# Altium schematic sheet DM3370_PCIE_CLK.SchDoc: =project_title
size Tabloid; CompanyName: Luxonis Holding; Organization: Luxonis Holding; Address1: 1925 Harmony Park Drive; Address2: Westminster, CO; Address3: 80234; Address4: United States; DocumentNumber: 13; SheetNumber: 13; SheetTotal: 17
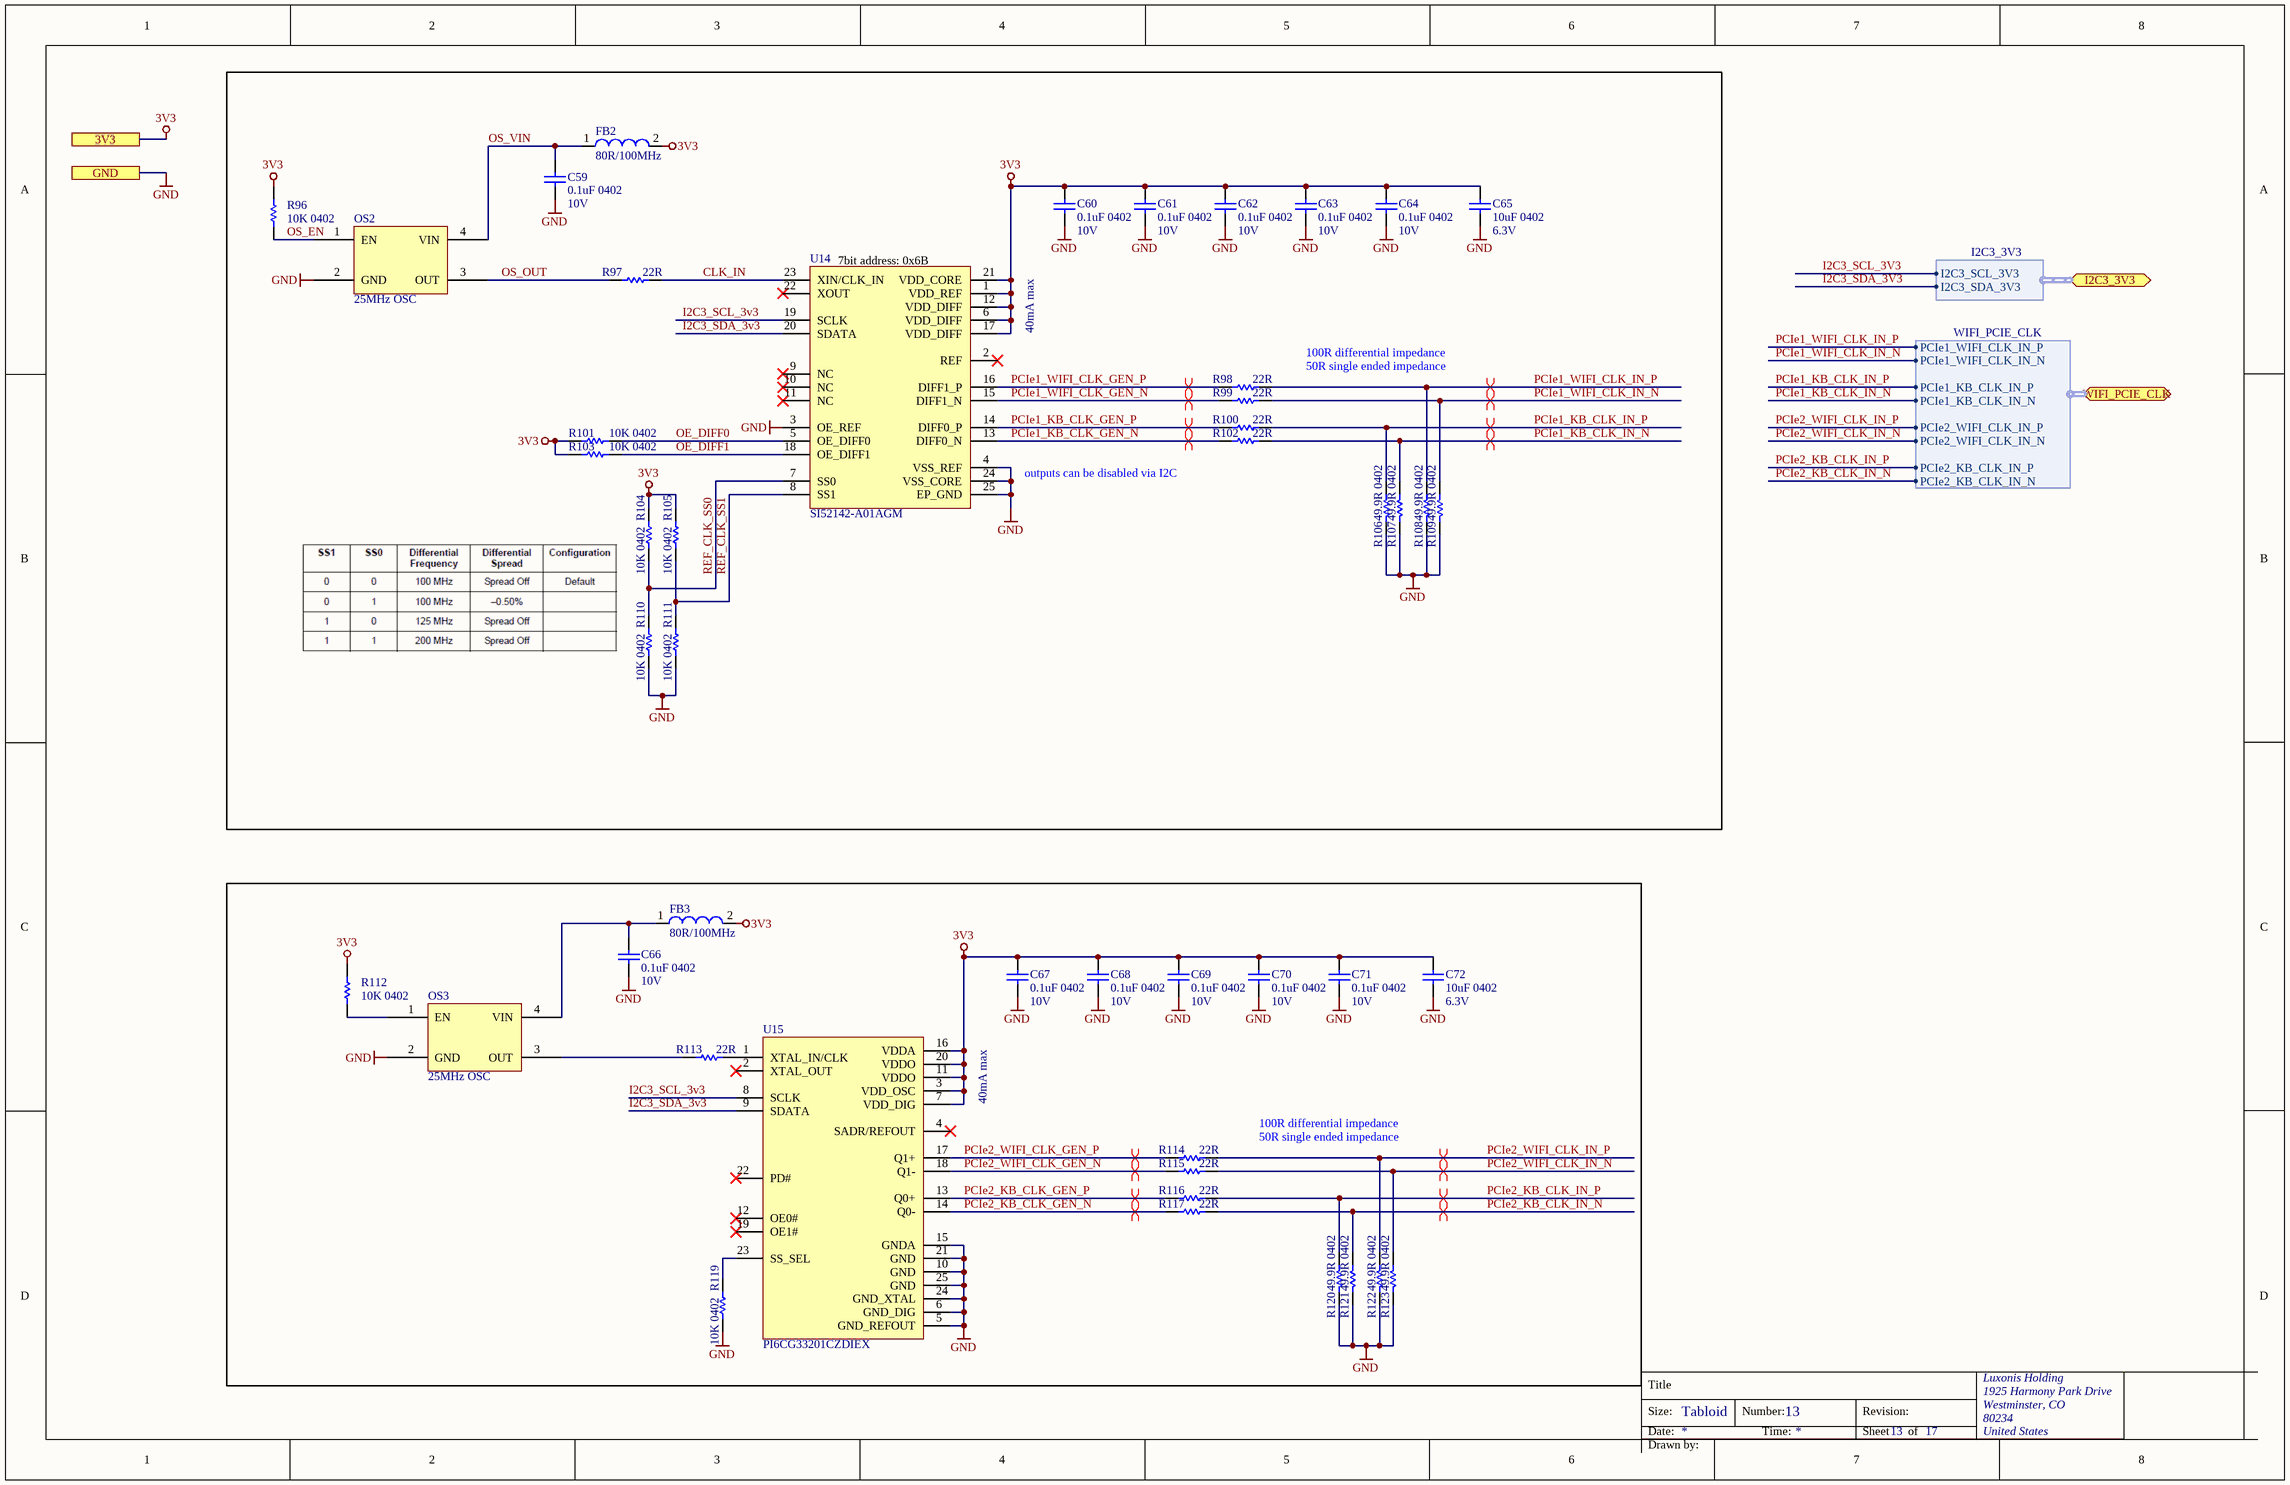
[diagram p0: DM3370_PCIE_CLK.SchDoc]

## Parts
C59  0.1uF 0402  Voltage Rating: 10V  [CAPC0402(1005)70_L]
C60  0.1uF 0402  Voltage Rating: 10V  [CAPC0402(1005)70_L]
C61  0.1uF 0402  Voltage Rating: 10V  [CAPC0402(1005)70_L]
C62  0.1uF 0402  Voltage Rating: 10V  [CAPC0402(1005)70_L]
C63  0.1uF 0402  Voltage Rating: 10V  [CAPC0402(1005)70_L]
C64  0.1uF 0402  Voltage Rating: 10V  [CAPC0402(1005)70_L]
C65  10uF 0402  Voltage Rating: 6.3V  [CAPC0402(1005)70_L]
C66  0.1uF 0402  Voltage Rating: 10V  [CAPC0402(1005)70_L]
C67  0.1uF 0402  Voltage Rating: 10V  [CAPC0402(1005)70_L]
C68  0.1uF 0402  Voltage Rating: 10V  [CAPC0402(1005)70_L]
C69  0.1uF 0402  Voltage Rating: 10V  [CAPC0402(1005)70_L]
C70  0.1uF 0402  Voltage Rating: 10V  [CAPC0402(1005)70_L]
C71  0.1uF 0402  Voltage Rating: 10V  [CAPC0402(1005)70_L]
C72  10uF 0402  Voltage Rating: 6.3V  [CAPC0402(1005)70_L]
FB2  80R/100MHz  [BK1608HS800-T_L]
FB3  80R/100MHz  [BK1608HS800-T_L]
OS2  25MHz OSC  [2520_OSC(FJ2400002)]
OS3  25MHz OSC  [2520_OSC(FJ2400002)]
R96  10K 0402  [RESC0402(1005)_L]
R97  Resistance: 22R  [RESC0402(1005)_L]  (hidden comment: RC0402FR-0722RL)
R98  Resistance: 22R  [RESC0402(1005)_L]  (hidden comment: RC0402FR-0722RL)
R99  Resistance: 22R  [RESC0402(1005)_L]  (hidden comment: RC0402FR-0722RL)
R100  Resistance: 22R  [RESC0402(1005)_L]  (hidden comment: RC0402FR-0722RL)
R101  10K 0402  [RESC0402(1005)_L]
R102  Resistance: 22R  [RESC0402(1005)_L]  (hidden comment: RC0402FR-0722RL)
R103  10K 0402  [RESC0402(1005)_L]
R104  10K 0402  [RESC0402(1005)_L]
R105  10K 0402  [RESC0402(1005)_L]
R106  49.9R 0402  [RESC0402(1005)_L]
R107  49.9R 0402  [RESC0402(1005)_L]
R108  49.9R 0402  [RESC0402(1005)_L]
R109  49.9R 0402  [RESC0402(1005)_L]
R110  10K 0402  [RESC0402(1005)_L]
R111  10K 0402  [RESC0402(1005)_L]
R112  10K 0402  [RESC0402(1005)_L]
R113  Resistance: 22R  [RESC0402(1005)_L]  (hidden comment: RC0402FR-0722RL)
R114  Resistance: 22R  [RESC0402(1005)_L]  (hidden comment: RC0402FR-0722RL)
R115  Resistance: 22R  [RESC0402(1005)_L]  (hidden comment: RC0402FR-0722RL)
R116  Resistance: 22R  [RESC0402(1005)_L]  (hidden comment: RC0402FR-0722RL)
R117  Resistance: 22R  [RESC0402(1005)_L]  (hidden comment: RC0402FR-0722RL)
R119  10K 0402  [RESC0402(1005)_L]
R120  49.9R 0402  [RESC0402(1005)_L]
R121  49.9R 0402  [RESC0402(1005)_L]
R122  49.9R 0402  [RESC0402(1005)_L]
R123  49.9R 0402  [RESC0402(1005)_L]
U14  SI52142-A01AGM  [SI52142-A01AGM]
U15  PI6CG33201CZDIEX  [PI6CG33201CZDIEX]

## Ports
3V3, GND, I2C3_3V3 (bidir, harness I2C3_3V3), WIFI_PCIE_CLK (bidir, harness WIFI_PCIE_CLK)

## Harnesses
WIFI_PCIE_CLK: PCIe1_WIFI_CLK_IN_P, PCIe1_WIFI_CLK_IN_N, PCIe1_KB_CLK_IN_P, PCIe1_KB_CLK_IN_N, PCIe2_WIFI_CLK_IN_P, PCIe2_WIFI_CLK_IN_N, PCIe2_KB_CLK_IN_P, PCIe2_KB_CLK_IN_N
I2C3_3V3: I2C3_SCL_3V3, I2C3_SDA_3V3

## Nets
3V3: C60.1 C61.1 C62.1 C63.1 C64.1 C65.2 C67.1 C68.1 C69.1 C70.1 C71.1 C72.2 FB2.2 FB3.2 R96.2 R101.1 R103.1 R104.1 R105.1 R112.2 U14.1(VDD_REF) U14.6(VDD_DIFF) U14.12(VDD_DIFF) U14.17(VDD_DIFF) U14.21(VDD_CORE) U15.3(VDD_OSC) U15.7(VDD_DIG) U15.11(VDDO) U15.16(VDDA) U15.20(VDDO) ; port 3V3
GND: C59.2 C60.2 C61.2 C62.2 C63.2 C64.2 C65.1 C66.2 C67.2 C68.2 C69.2 C70.2 C71.2 C72.1 OS2.2(GND) OS3.2(GND) R106.2 R107.1 R108.1 R109.1 R110.2 R111.2 R119.2 R120.2 R121.1 R122.1 R123.1 U14.3(OE_REF) U14.4(VSS_REF) U14.24(VSS_CORE) U14.25(EP_GND) U15.5(GND_REFOUT) U15.6(GND_DIG) U15.10(GND) U15.15(GNDA) U15.21(GND) U15.24(GND_XTAL) U15.25(GND) ; port GND
CLK_IN: R97.2 U14.23(XIN/CLK_IN)
I2C3_SCL_3v3: U14.19(SCLK) U15.8(SCLK) ; port I2C3_3V3.I2C3_SCL_3V3
I2C3_SDA_3v3: U14.20(SDATA) U15.9(SDATA) ; port I2C3_3V3.I2C3_SDA_3V3
OE_DIFF0: R101.2 U14.5(OE_DIFF0)
OE_DIFF1: R103.2 U14.18(OE_DIFF1)
OS_EN: OS2.1(EN) R96.1
OS_OUT: OS2.3(OUT) R97.1
OS_VIN: C59.1 FB2.1 OS2.4(VIN)
PCIe1_KB_CLK_GEN_N: R102.1 U14.13(DIFF0_N)
PCIe1_KB_CLK_GEN_P: R100.1 U14.14(DIFF0_P)
PCIe1_KB_CLK_IN_N: R102.2 R107.2 ; port WIFI_PCIE_CLK.PCIe1_KB_CLK_IN_N
PCIe1_KB_CLK_IN_P: R100.2 R106.1 ; port WIFI_PCIE_CLK.PCIe1_KB_CLK_IN_P
PCIe1_WIFI_CLK_GEN_N: R99.1 U14.15(DIFF1_N)
PCIe1_WIFI_CLK_GEN_P: R98.1 U14.16(DIFF1_P)
PCIe1_WIFI_CLK_IN_N: R99.2 R109.2 ; port WIFI_PCIE_CLK.PCIe1_WIFI_CLK_IN_N
PCIe1_WIFI_CLK_IN_P: R98.2 R108.2 ; port WIFI_PCIE_CLK.PCIe1_WIFI_CLK_IN_P
PCIe2_KB_CLK_GEN_N: R117.1 U15.14(Q0-)
PCIe2_KB_CLK_GEN_P: R116.1 U15.13(Q0+)
PCIe2_KB_CLK_IN_N: R117.2 R121.2 ; port WIFI_PCIE_CLK.PCIe2_KB_CLK_IN_N
PCIe2_KB_CLK_IN_P: R116.2 R120.1 ; port WIFI_PCIE_CLK.PCIe2_KB_CLK_IN_P
PCIe2_WIFI_CLK_GEN_N: R115.1 U15.18(Q1-)
PCIe2_WIFI_CLK_GEN_P: R114.1 U15.17(Q1+)
PCIe2_WIFI_CLK_IN_N: R115.2 R123.2 ; port WIFI_PCIE_CLK.PCIe2_WIFI_CLK_IN_N
PCIe2_WIFI_CLK_IN_P: R114.2 R122.2 ; port WIFI_PCIE_CLK.PCIe2_WIFI_CLK_IN_P
REF_CLK_SS0: R104.2 R110.1 U14.7(SS0)
REF_CLK_SS1: R105.2 R111.1 U14.8(SS1)
NetC66_1: C66.1 FB3.1 OS3.4(VIN)
NetOS3_1: OS3.1(EN) R112.1
NetOS3_3: OS3.3(OUT) R113.1
NetR113_2: R113.2 U15.1(XTAL_IN/CLK)
NetR119_1: R119.1 U15.23(SS_SEL)

Not connected (* = marked no-connect by the designer): U14 2(REF)* 9(NC)* 10(NC)* 11(NC)* 22(XOUT)*; U15 2(XTAL_OUT)* 4(SADR/REFOUT)* 12(OE0#)* 19(OE1#)* 22(PD#)*

## Layout directives
differential pair; net class PCIE; differential pair class 100ohm: PCIe1_KB_CLK_GEN_N, PCIe1_KB_CLK_GEN_P, PCIe1_KB_CLK_IN_N, PCIe1_KB_CLK_IN_P, PCIe1_WIFI_CLK_GEN_N, PCIe1_WIFI_CLK_GEN_P, PCIe1_WIFI_CLK_IN_N, PCIe1_WIFI_CLK_IN_P, PCIe2_KB_CLK_GEN_N, PCIe2_KB_CLK_GEN_P, PCIe2_KB_CLK_IN_N, PCIe2_KB_CLK_IN_P, PCIe2_WIFI_CLK_GEN_N, PCIe2_WIFI_CLK_GEN_P, PCIe2_WIFI_CLK_IN_N, PCIe2_WIFI_CLK_IN_P

## Notes on the sheet
- (near U14) 7bit address: 0x6B
- 40mA max
- 100R differential impedance
- 50R single ended impedance
- outputs can be disabled via I2C
- Schematic based on the PCIe refclk and control circuitry on the MV0235 reference design.
- Title
- Size:
- Date:
- Tabloid
- Number:
- Time:
- Revision:
- Sheet
- of
- Drawn by:

## Library data of the parts
C59-C64 C66-C71 = GRM155R71A104JA01D: CAP CER 0.1UF 10V X7R 0402 5%; Manufacturer 1: Murata; Capacitance: 100nF; Supplier 1: Digi-Key; Manufacturer Part Number 1: GRM155R71A104JA01D; Stock 1: 1346709; Pricing 1: 1=0.10000, 10=0.02500, 100=0.01130, 500=0.00806, 1000=0.00633, 2500=0.00575, 5000=0.00529 (USD); RoHS: Yes; Mount: Surface Mount; Case/Package: 0402; Case Code (Imperial): 0402; Case Code (Metric): 1005; Min Operating Temperature: -55°C; Max Operating Temperature: 125°C; Tolerance: 5%; Packaging: Tape and Reel; Voltage Rating (DC): 10V; Dielectric: X7R; Package Quantity: 10000; Termination: SMD/SMT; Length: 1mm; Height: 0.5mm; Width: 0.02inch; Thickness: 0.022inch; Depth: 0.5mm; Radiation Hardening: No; Lead Free: Lead Free; ComponentLink1URL: https://datasheet.ciiva.com/5411/product-5411135.pdf?src-supplier=Mouser; ComponentLink1Description: https://datasheet.ciiva.com/5411/product-5411135.pdf?src-supplier=Mouser; ComponentLink2URL: https://datasheet.ciiva.com/11618/c02e-11618821.pdf?src-supplier=Avnet; ComponentLink2Description: https://datasheet.ciiva.com/11618/c02e-11618821.pdf?src-supplier=Avnet; Supplier Part Number 1: 490-10777-1-ND
C65 C72 = GRM155R60J106ME15D: CAP CER 10UF 6.3V X5R 0402 20%; Manufacturer 1: Murata; Supplier 1: Digi-Key; Manufacturer Part Number 1: GRM155R60J106ME15D; Stock 1: 1839627; Pricing 1: 1=0.23000, 10=0.15700, 100=0.07950, 500=0.05442, 1000=0.04814, 2500=0.04605, 5000=0.04186 (USD); RoHS: Yes; Mount: Surface Mount; Case/Package: 0402; Case Code (Metric): 1005; Case Code (Imperial): 0402; Min Operating Temperature: -55°C; Max Operating Temperature: 85°C; Packaging: Tape and Reel; Capacitance: 10uF; Dielectric: X5R; Length: 0.039inch; Width: 0.02inch; ComponentLink1URL: https://www.murata.com/~/media/webrenewal/support/library/catalog/products/capacitor/mlcc/c02e.ashx?la=en-us&src-supplier=Digi-Key; ComponentLink1Description: https://www.murata.com/~/media/webrenewal/support/library/catalog/products/capacitor/mlcc/c02e.ashx?la=en-us&src-supplier=Digi-Key; Supplier Part Number 1: 490-13238-1-ND; Voltage Rating (DC): 6.3V; Thickness: 0.026inch; Tolerance: 20%
FB2 FB3 = BK1608HS800-T: FERRITE BEAD 80 OHM 0603 1LN; Manufacturer 1: Taiyo Yuden; Impedance: 80R; Tolerance: 25%; Max DC Current: 600mA; DC Resistance (DCR): 100mR; Test Frequency: 100MHz; Number of Lines: 1; Shielding: Shielded; Supplier 1: Digi-Key; Manufacturer Part Number 1: BK1608HS800-T; Stock 1: 6285; Pricing 1: 1=0.10000, 10=0.07900, 25=0.07200, 50=0.06480, 100=0.04760, 250=0.03460, 500=0.03170, 1000=0.02738 (USD); RoHS: Yes; Mount: Surface Mount; Case/Package: 0603; Number of Pins: 2; Core Material: Ferrite; Case Code (Metric): 1608; Case Code (Imperial): 0603; Min Operating Temperature: -55°C; Max Operating Temperature: 125°C; Package Quantity: 1; Packaging: Tape and Reel; Termination: SMD/SMT; Max Current Rating: 600mA; Frequency: 100MHz; Length: 0.063inch; Height: 0.037inch; Width: 0.8mm; Depth: 0.95mm; REACH SVHC: Unknown; Lead Free: Lead Free; Halogen Free: Halogen Free; ComponentLink1URL: https://datasheet.ciiva.com/1011/bk1608hs800-t-ss-1011885.pdf?src-supplier=Digi-Key; ComponentLink1Description: https://datasheet.ciiva.com/1011/bk1608hs800-t-ss-1011885.pdf?src-supplier=Digi-Key; ComponentLink2URL: https://datasheet.ciiva.com/1011/mlci07-e-1011886.pdf?src-supplier=Digi-Key; ComponentLink2Description: https://datasheet.ciiva.com/1011/mlci07-e-1011886.pdf?src-supplier=Digi-Key; ComponentLink3URL: https://datasheet.ciiva.com/1011/mlci07-e-1011887.pdf?src-supplier=Digi-Key; ComponentLink3Description: https://datasheet.ciiva.com/1011/mlci07-e-1011887.pdf?src-supplier=Digi-Key; Supplier 2: Mouser; Supplier 3: Arrow; Supplier Part Number 1: 587-1875-1-ND; Supplier Part Number 2: 963-BK1608HS800-T; Supplier Part Number 3: BK1608HS800-T
OS2 OS3 = ASDMB-25.000MHZ-LC-T: MEMS OSC XO 25.0000MHZ LVCMOS; Manufacturer 1: Abracon; Load Capacitance: 15pF; Operating Supply Voltage: 3.3V; Max Supply Voltage: 4V; Min Supply Voltage: -300mV; Max Supply Current: 16mA; Frequency Stability: 50ppm; Supplier 1: Digi-Key; Manufacturer Part Number 1: ASDMB-25.000MHZ-LC-T; RoHS: Yes; Category: Oscillators; Stock 1: 3088; Pricing 1: 1=2.09000, 10=1.99800, 50=1.95200, 100=1.67310, 500=1.62662 (USD); Mount: Surface Mount; Case/Package: SMD/SMT; Number of Pins: 4; Min Operating Temperature: -40°C; Max Operating Temperature: 85°C; Packaging: Tape and Reel; Frequency: 25MHz; Termination: SMD/SMT; Length: 0.098inch; Height: 0.035inch; Width: 0.079inch; Lead Free: Lead Free; ComponentLink1URL: https://datasheet.ciiva.com/868/asdmb-868249.pdf?src-supplier=Digi-Key; ComponentLink1Description: https://datasheet.ciiva.com/868/asdmb-868249.pdf?src-supplier=Digi-Key; ComponentLink2URL: https://datasheet.ciiva.com/868/asdmb-868250.pdf?src-supplier=Digi-Key; ComponentLink2Description: https://datasheet.ciiva.com/868/asdmb-868250.pdf?src-supplier=Digi-Key; ComponentLink3URL: https://datasheet.ciiva.com/868/asdmb-868251.pdf?src-supplier=Digi-Key; ComponentLink3Description: https://datasheet.ciiva.com/868/asdmb-868251.pdf?src-supplier=Digi-Key; ComponentLink4URL: https://datasheet.ciiva.com/13166/asdmb-29928-13166571.pdf?src-supplier=Mouser; ComponentLink4Description: https://datasheet.ciiva.com/13166/asdmb-29928-13166571.pdf?src-supplier=Mouser; Supplier 2: Newark; Supplier 3: Mouser; Supplier Part Number 3: 815-ASDMB-25MHZ-LC; Supplier Part Number 2: 56AC7555; Supplier Part Number 1: 535-11730-1-ND
R96 R101 R103-R105 R110-R112 R119 = RC0402FR-1310KL: RES SMD 10K OHM 1% 0402 1/16W Chip Resistor, 0402 [1005 Metric], 10 kohm, RC Series, 50 V, Thick Film, 62.5 mW; Manufacturer 1: Yageo; Resistance: 10kR; Temperature Coefficient: 100ppm/°C; Power Rating: 62.5mW; Voltage Rating: 50V; ComponentLink1URL: https://datasheet.ciiva.com/16940/pyu-rc0402-51-rohs-l-6-16940293.pdf?src-supplier=Avnet+Europe; ComponentLink1Description: https://datasheet.ciiva.com/16940/pyu-rc0402-51-rohs-l-6-16940293.pdf?src-supplier=Avnet+Europe; ComponentLink2URL: https://datasheet.ciiva.com/28386/pyu-rc0402-51-rohs-l-6-28386855.pdf?src-supplier=Avnet+Europe; ComponentLink2Description: https://datasheet.ciiva.com/28386/pyu-rc0402-51-rohs-l-6-28386855.pdf?src-supplier=Avnet+Europe; ComponentLink3URL: https://datasheet.ciiva.com/16740/pyu-rc0402-51-rohs-l-6-r-16740602.pdf?src-supplier=Future+Electronics; ComponentLink3Description: https://datasheet.ciiva.com/16740/pyu-rc0402-51-rohs-l-6-r-16740602.pdf?src-supplier=Future+Electronics; ComponentLink4URL: https://datasheet.ciiva.com/8891/pyu-rc0402-51-rohs-l-6-8891339.pdf?src-supplier=Avnet; ComponentLink4Description: https://datasheet.ciiva.com/8891/pyu-rc0402-51-rohs-l-6-8891339.pdf?src-supplier=Avnet; ComponentLink5URL: https://datasheet.ciiva.com/5557/pyu-rc0402-51-rohs-l-6-r-5557997.pdf?src-supplier=Mouser; ComponentLink5Description: https://datasheet.ciiva.com/5557/pyu-rc0402-51-rohs-l-6-r-5557997.pdf?src-supplier=Mouser; ComponentLink6URL: https://datasheet.ciiva.com/7983/1018594-7983533.pdf?src-supplier=Element14; ComponentLink6Description: https://datasheet.ciiva.com/7983/1018594-7983533.pdf?src-supplier=Element14; Supplier 1: Newark; Manufacturer Part Number 1: RC0402FR-1310KL; Stock 1: 62239; Pricing 1: 1=0.10000, 25=0.01200, 100=0.00400, 250=0.00400, 500=0.00300, 1000=0.00300 (USD); RoHS: Yes; Case/Package: 0402; Number of Pins: 2; Contact Plating: Tin,Matte,Lead; Case Code (Imperial): 0402; Case Code (Metric): 1005; Min Operating Temperature: -55°C; Max Operating Temperature: 155°C; Tolerance: 1%; Composition: Thick Film; Packaging: Tape and Reel; Termination: SMD/SMT; Military Standard: Not; Voltage Rating (DC): 50V; Working Voltage: 50V; Number of Terminations: 2; Length: 1mm; Depth: 0.5mm; Radiation Hardening: No; REACH SVHC: No SVHC; Lead Free: Lead Free; Supplier Part Number 1: 67R9960; Supplier 2: Future Electronics; Supplier 3: Mouser; Supplier 4: Element14; Supplier Part Number 2: RC0402FR-1310KL-CUTT; Supplier Part Number 3: 603-RC0402FR-1310KL; Supplier Part Number 4: 1799235
R97-R100 R102 R113-R117 = CMP-013-000012-2: RES SMD 22 OHM 1% 1/16W 0402; Manufacturer 1: Yageo; Rated Power Dissipation (P): 62.5mW; Category: Chip SMD Resistors; Manufacturer Part Number 1: RC0402FR-0722RL; Tolerance: 1%; Min Operating Temperature: -55°C; RoHS Compliant: Yes; Number of Pins: 2; Design Item ID: RC0402FR-0722RL; Max Operating Temperature: 155°C
R106-R109 R120-R123 = RC0402FR-0749R9L: RES SMD 49.9 OHM 1% 1/16W 0402; Manufacturer 1: Yageo; Power Rating: 62.5mW; Temperature Coefficient: 100ppm/°C; Voltage Rating: 50V; Max Power Dissipation: 63mW; Supplier 1: Digi-Key; Manufacturer Part Number 1: RC0402FR-0749R9L; Stock 1: 15110719; Pricing 1: 1=0.10000, 10=0.01600, 100=0.00640, 1000=0.00289, 2500=0.00251, 5000=0.00207 (USD); RoHS: Yes; Case/Package: 0402; Number of Pins: 2; Case Code (Imperial): 0402; Case Code (Metric): 1005; Min Operating Temperature: -55°C; Max Operating Temperature: 155°C; Packaging: Tape and Reel; Resistance: 49.9R; Tolerance: 1%; Composition: Thick Film; Number of Terminations: 2; Package Quantity: 1; Termination: SMD/SMT; Military Standard: Not; Voltage Rating (DC): 50V; Features: Moisture Resistant; Working Voltage: 50V; Length: 1mm; Height: 0.016inch; Width: 0.5mm; Depth: 0.5mm; Lead Free: Lead Free; REACH SVHC: No SVHC; ComponentLink1URL: https://datasheet.ciiva.com/11819/0900766b80c66297-11819508.pdf?src-supplier=RSComponents; ComponentLink1Description: https://datasheet.ciiva.com/11819/0900766b80c66297-11819508.pdf?src-supplier=RSComponents; ComponentLink2URL: https://datasheet.ciiva.com/7983/1018594-7983542.pdf?src-supplier=Element14; ComponentLink2Description: https://datasheet.ciiva.com/7983/1018594-7983542.pdf?src-supplier=Element14; ComponentLink3URL: https://datasheet.ciiva.com/16743/pyu-rc0402-51-rohs-l-6-r-16743942.pdf?src-supplier=Future+Electronics; ComponentLink3Description: https://datasheet.ciiva.com/16743/pyu-rc0402-51-rohs-l-6-r-16743942.pdf?src-supplier=Future+Electronics; ComponentLink4URL: https://datasheet.ciiva.com/22747/1018594-22747514.pdf?src-supplier=Element14; ComponentLink4Description: https://datasheet.ciiva.com/22747/1018594-22747514.pdf?src-supplier=Element14; ComponentLink5URL: https://datasheet.ciiva.com/2453/pyu-r-int-thick-7-2453355.pdf?src-supplier=Digi-Key; ComponentLink5Description: https://datasheet.ciiva.com/2453/pyu-r-int-thick-7-2453355.pdf?src-supplier=Digi-Key; ComponentLink6URL: https://datasheet.ciiva.com/2453/pyu-r-int-thick-7-2453356.pdf?src-supplier=Digi-Key; ComponentLink6Description: https://datasheet.ciiva.com/2453/pyu-r-int-thick-7-2453356.pdf?src-supplier=Digi-Key; ComponentLink7URL: https://datasheet.ciiva.com/2453/pyu-r-int-thick-7-2453357.pdf?src-supplier=Digi-Key; ComponentLink7Description: https://datasheet.ciiva.com/2453/pyu-r-int-thick-7-2453357.pdf?src-supplier=Digi-Key; Supplier 2: Mouser; Supplier Part Number 1: 311-49.9LRCT-ND; Supplier Part Number 2: 603-RC0402FR-0749R9L
U14 = CMP-099-000003-1: IC CLK GENERATOR 200MHZ 24QFN; Manufacturer 1: Silicon Labs; Max Supply Voltage: 3.465V; PLL: Yes; Operating Supply Voltage: 3.3V; Input: Clock; Number of Outputs: 2; Min Supply Voltage: 3.135V; Frequency: 100MHz; Number of Circuits: 1; Max Duty Cycle: 55%; Category: Clock and Timing; Manufacturer Part Number 1: SI52142-A01AGM; Number of Pins: 24; ComponentLink2URL: https://datasheet.ciiva.com/26919/getdatasheetpartid-550913-26919827.pdf?src-supplier=Verical; Max Frequency: 200MHz; ComponentLink3URL: https://datasheet.ciiva.com/46413/1813417-46413349.pdf?src-supplier=Element14; Design Item ID: SI52142-A01AGM; Package Quantity: 490; ComponentLink4Description: https://datasheet.ciiva.com/4771/si52142-4771159.pdf?src-supplier=Mouser; Source: NG2391C-HM.SchLib; Length: 4mm; Stock 1: 398; Radiation Hardening: No; Packaging: Tray; ComponentLink2Description: https://datasheet.ciiva.com/26919/getdatasheetpartid-550913-26919827.pdf?src-supplier=Verical; Min Operating Temperature: -40°C; ComponentLink1URL: https://datasheet.ciiva.com/1178/si52142-1178690.pdf?src-supplier=Digi-Key; ComponentLink4URL: https://datasheet.ciiva.com/4771/si52142-4771159.pdf?src-supplier=Mouser; REACH SVHC: Unknown; ComponentLink1Description: https://datasheet.ciiva.com/1178/si52142-1178690.pdf?src-supplier=Digi-Key; ComponentLink3Description: https://datasheet.ciiva.com/46413/1813417-46413349.pdf?src-supplier=Element14; Max Operating Temperature: 85°C; Width: 4mm; Pricing 1: 1=1.81000, 25=1.66320, 100=1.51200, 1000=1.36080 (USD); RoHS: Yes; Case/Package: QFN; Height: 0.75mm
U15 = CMP-023-00002-2: Clock Generator V-QFN4040-24 T&r 3.5K; Manufacturer 1: Diodes; PLL: Yes; Input: Crystal; Number of Circuits: 1; Max Frequency: 100MHz; Category: Clock Generators, PLLs, Frequency Synthesizers; Design Item ID: PI6CG33201CZDIEX; Manufacturer Part Number 1: PI6CG33201CZDIEX; Max Operating Temperature: 85°C; Series: Automotive, AEC-Q100; Mount: Surface Mount; Packaging: Tape and Reel; Min Operating Temperature: -40°C